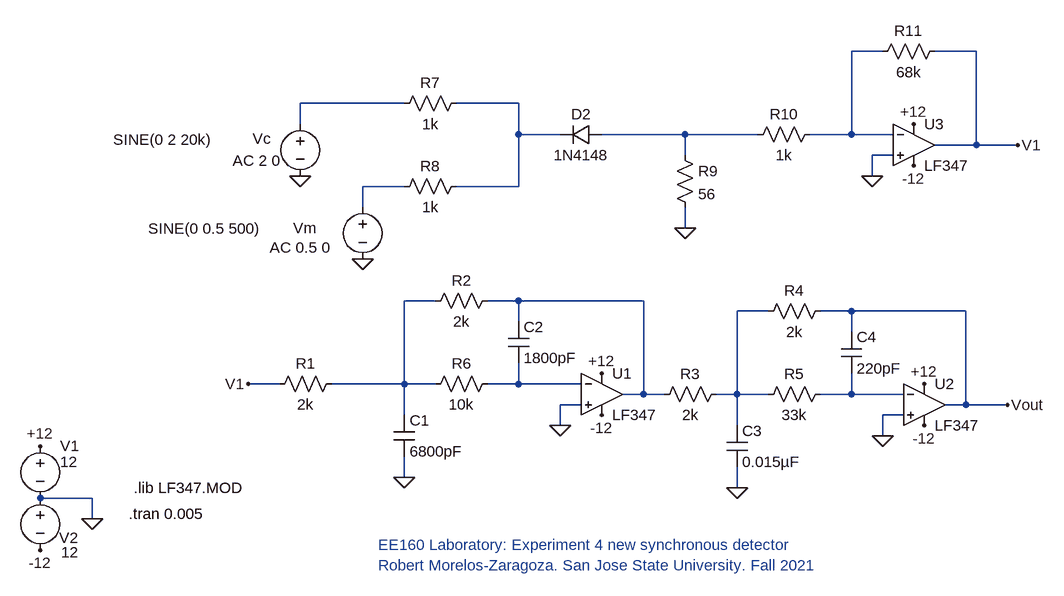
[diagram p0: schematic mixing_diode_sync_detector.asc]
mixing_diode_sync_detector.asc, the LTspice schematic file:
Version 4
SHEET 1 880 680
WIRE 384 -1296 336 -1296
WIRE 528 -1296 464 -1296
WIRE -352 -1216 -512 -1216
WIRE -176 -1216 -272 -1216
WIRE -512 -1184 -512 -1216
WIRE -176 -1168 -176 -1216
WIRE -112 -1168 -176 -1168
WIRE 80 -1168 -48 -1168
WIRE 192 -1168 80 -1168
WIRE 336 -1168 336 -1296
WIRE 336 -1168 272 -1168
WIRE 400 -1168 336 -1168
WIRE 528 -1152 528 -1296
WIRE 528 -1152 464 -1152
WIRE 592 -1152 528 -1152
WIRE 80 -1136 80 -1168
WIRE 400 -1136 368 -1136
WIRE 368 -1104 368 -1136
WIRE -352 -1088 -416 -1088
WIRE -176 -1088 -176 -1168
WIRE -176 -1088 -272 -1088
WIRE -416 -1056 -416 -1088
WIRE 80 -1024 80 -1056
WIRE -304 -912 -352 -912
WIRE -176 -912 -224 -912
WIRE 16 -912 -176 -912
WIRE 208 -896 160 -896
WIRE 336 -896 288 -896
WIRE 512 -896 336 -896
WIRE -176 -880 -176 -912
WIRE 336 -864 336 -896
WIRE -544 -784 -592 -784
WIRE -352 -784 -352 -912
WIRE -352 -784 -464 -784
WIRE -304 -784 -352 -784
WIRE -176 -784 -176 -816
WIRE -176 -784 -224 -784
WIRE -80 -784 -176 -784
WIRE 16 -768 16 -912
WIRE 16 -768 -16 -768
WIRE 48 -768 16 -768
WIRE 160 -768 160 -896
WIRE 160 -768 128 -768
WIRE 208 -768 160 -768
WIRE 336 -768 336 -800
WIRE 336 -768 288 -768
WIRE 416 -768 336 -768
WIRE -80 -752 -112 -752
WIRE 512 -752 512 -896
WIRE 512 -752 480 -752
WIRE 576 -752 512 -752
WIRE -352 -736 -352 -784
WIRE 416 -736 384 -736
WIRE -112 -720 -112 -752
WIRE 160 -720 160 -768
WIRE 384 -704 384 -736
WIRE -352 -640 -352 -672
WIRE 160 -624 160 -656
WIRE -832 -608 -912 -608
WIRE -832 -576 -832 -608
FLAG -832 -576 0
FLAG -912 -688 +12
FLAG -912 -528 -12
FLAG -48 -800 +12
FLAG -48 -736 -12
FLAG -112 -720 0
FLAG -352 -640 0
FLAG 448 -784 +12
FLAG 448 -720 -12
FLAG 384 -704 0
FLAG 160 -624 0
FLAG 576 -752 Vout
FLAG 80 -1024 0
FLAG -512 -1104 0
FLAG -416 -976 0
FLAG 592 -1152 V1
FLAG -592 -784 V1
FLAG 432 -1120 -12
FLAG 432 -1184 +12
FLAG 368 -1104 0
SYMBOL Opamps\\opamp2 -48 -832 R0
SYMATTR InstName U1
SYMATTR Value LF347
SYMBOL voltage -912 -704 R0
WINDOW 0 31 15 Left 2
WINDOW 3 31 40 Left 2
WINDOW 123 0 0 Left 2
WINDOW 39 0 0 Left 2
SYMATTR InstName V1
SYMATTR Value 12
SYMBOL voltage -912 -624 R0
WINDOW 0 29 77 Left 2
WINDOW 3 32 99 Left 2
WINDOW 123 0 0 Left 2
WINDOW 39 0 0 Left 2
SYMATTR InstName V2
SYMATTR Value 12
SYMBOL res -560 -768 R270
WINDOW 0 32 56 VTop 2
WINDOW 3 0 56 VBottom 2
SYMATTR InstName R1
SYMATTR Value 2k
SYMBOL cap -368 -736 R0
SYMATTR InstName C1
SYMATTR Value 6800pF
SYMBOL res -320 -896 R270
WINDOW 0 32 56 VTop 2
WINDOW 3 0 56 VBottom 2
SYMATTR InstName R2
SYMATTR Value 2k
SYMBOL res -320 -768 R270
WINDOW 0 32 56 VTop 2
WINDOW 3 0 56 VBottom 2
SYMATTR InstName R6
SYMATTR Value 10k
SYMBOL cap -192 -880 R0
SYMATTR InstName C2
SYMATTR Value 1800pF
SYMBOL Opamps\\opamp2 448 -816 R0
SYMATTR InstName U2
SYMATTR Value LF347
SYMBOL res 32 -752 R270
WINDOW 0 32 56 VTop 2
WINDOW 3 0 56 VBottom 2
SYMATTR InstName R3
SYMATTR Value 2k
SYMBOL cap 144 -720 R0
SYMATTR InstName C3
SYMATTR Value 0.015µF
SYMBOL res 192 -880 R270
WINDOW 0 32 56 VTop 2
WINDOW 3 0 56 VBottom 2
SYMATTR InstName R4
SYMATTR Value 2k
SYMBOL res 192 -752 R270
WINDOW 0 32 56 VTop 2
WINDOW 3 0 56 VBottom 2
SYMATTR InstName R5
SYMATTR Value 33k
SYMBOL cap 320 -864 R0
SYMATTR InstName C4
SYMATTR Value 220pF
SYMBOL res -368 -1200 R270
WINDOW 0 32 56 VTop 2
WINDOW 3 0 56 VBottom 2
SYMATTR InstName R7
SYMATTR Value 1k
SYMBOL res -368 -1072 R270
WINDOW 0 32 56 VTop 2
WINDOW 3 0 56 VBottom 2
SYMATTR InstName R8
SYMATTR Value 1k
SYMBOL res 64 -1152 R0
SYMATTR InstName R9
SYMATTR Value 56
SYMBOL voltage -512 -1200 R0
WINDOW 123 -104 72 Left 2
WINDOW 39 0 0 Left 2
WINDOW 0 -73 38 Left 2
WINDOW 3 -288 40 Left 2
SYMATTR Value2 AC 2 0
SYMATTR InstName Vc
SYMATTR Value SINE(0 2 20k)
SYMBOL voltage -416 -1072 R0
WINDOW 123 -143 78 Left 2
WINDOW 39 0 0 Left 2
WINDOW 0 -107 48 Left 2
WINDOW 3 -330 49 Left 2
SYMATTR Value2 AC 0.5 0
SYMATTR InstName Vm
SYMATTR Value SINE(0 0.5 500)
SYMBOL Opamps\\opamp2 432 -1216 R0
SYMATTR InstName U3
SYMATTR Value LF347
SYMBOL res 176 -1152 R270
WINDOW 0 32 56 VTop 2
WINDOW 3 0 56 VBottom 2
SYMATTR InstName R10
SYMATTR Value 1k
SYMBOL res 368 -1280 R270
WINDOW 0 32 56 VTop 2
WINDOW 3 0 56 VBottom 2
SYMATTR InstName R11
SYMATTR Value 68k
SYMBOL diode -48 -1184 R90
WINDOW 0 0 32 VBottom 2
WINDOW 3 32 32 VTop 2
SYMATTR InstName D2
SYMATTR Value 1N4148
TEXT -768 -624 Left 2 !.lib LF347.MOD
TEXT -776 -584 Left 2 !.tran 0.005
TEXT -392 -536 Left 2 ;EE160 Laboratory: Experiment 4 new synchronous detector\nRobert Morelos-Zaragoza. San Jose State University. Fall 2021

The netlist it stands for:
* mixing_diode_sync_detector.asc
XU1 0 N009 +12 -12 N007 LF347  ; pins In+ In- V+ V- OUT
V1 +12 0 12
V2 0 -12 12
R1 V1 N006 2k
C1 N006 0 6800pF
R2 N006 N007 2k
R6 N006 N009 10k
C2 N007 N009 1800pF
XU2 0 N010 +12 -12 Vout LF347  ; pins In+ In- V+ V- OUT
R3 N007 N008 2k
C3 N008 0 0.015µF
R4 N008 Vout 2k
R5 N008 N010 33k
C4 Vout N010 220pF
R7 N002 N003 1k
R8 N005 N003 1k
R9 N004 0 56
Vc N002 0 SINE(0 2 20k) AC 2 0
Vm N005 0 SINE(0 0.5 500) AC 0.5 0
XU3 0 N001 +12 -12 V1 LF347  ; pins In+ In- V+ V- OUT
R10 N004 N001 1k
R11 N001 V1 68k
D2 N004 N003 1N4148
.model D D
.lib standard.dio
.lib LF347.MOD
.tran 0.005
* EE160 Laboratory: Experiment 4 new synchronous detector
* Robert Morelos-Zaragoza. San Jose State University. Fall 2021
.backanno
.end